# EAGLE design relais-adapter (EAGLE 7.5.0)
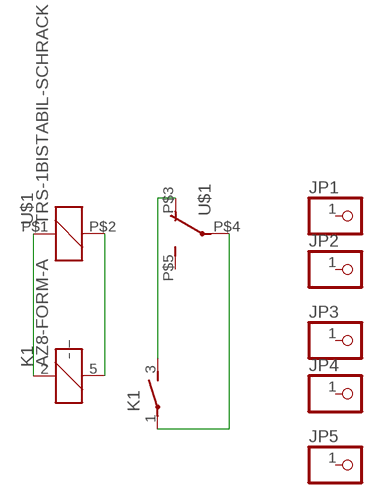
[diagram p0: schematic, sheet 1]

## Parts
JP1  PINHD-1X1  [1X01]
JP2  PINHD-1X1  [1X01]
JP3  PINHD-1X1  [1X01]
JP4  PINHD-1X1  [1X01]
JP5  PINHD-1X1  [1X01]
K1  AZ8-FORM-A  [AZ8]
U$1  TRS-1BISTABIL-SCHRACK  [PRINTRELAIS-SCHRACK-PE-BISTABIL]

## Nets
N$1: K1.2 U$1.P$1
N$2: K1.5 U$1.P$2
N$3: K1.3(-1:S) U$1.P$3(O)
N$4: K1.1(-1:P) U$1.P$4(P)
Unconnected: JP1.1 JP2.1 JP3.1 JP4.1 JP5.1 U$1.P$5(S)

## Library data of the parts
JP1-JP5 = pinhead:PINHD-1X1: PIN HEADER
K1 = 0liver:AZ8-FORM-A: MINIATURE PC BOARD RELAY Form A Source: www.azettler.com .. AZ8-1ch-12DSE.PDF; OC_FARNELL: unknown; OC_NEWARK: unknown
U$1 = 0liver:TRS-1: TRS-1 12V Hochstromrelais Allgemeines Typ Automotive Powerrelais Technologie monostabil Ausführung Ausführung 1x Wechsler Anschlüsse / Schnittstellen Anschluss Printmontage Kontakte AgSnO Elektrische Werte Schaltleistung 420 VA Voltage DC 12 V= Innenwiderstand (Ri) 253 Ohm Nennstrom 30 (16 V DC) A Max. Schaltstrom 30 A Leistungsaufnahme (Betrieb) 0,57 W Prüfspannung 500 V Maße Länge 13,2 mm Breite 12,3 mm Höhe 9,8 mm http://www.reichelt.de/index.html?&ACTION=7&LA=3&OPEN=0&INDEX=0&FILENAME=C300%252FTRS.pdf

## Board
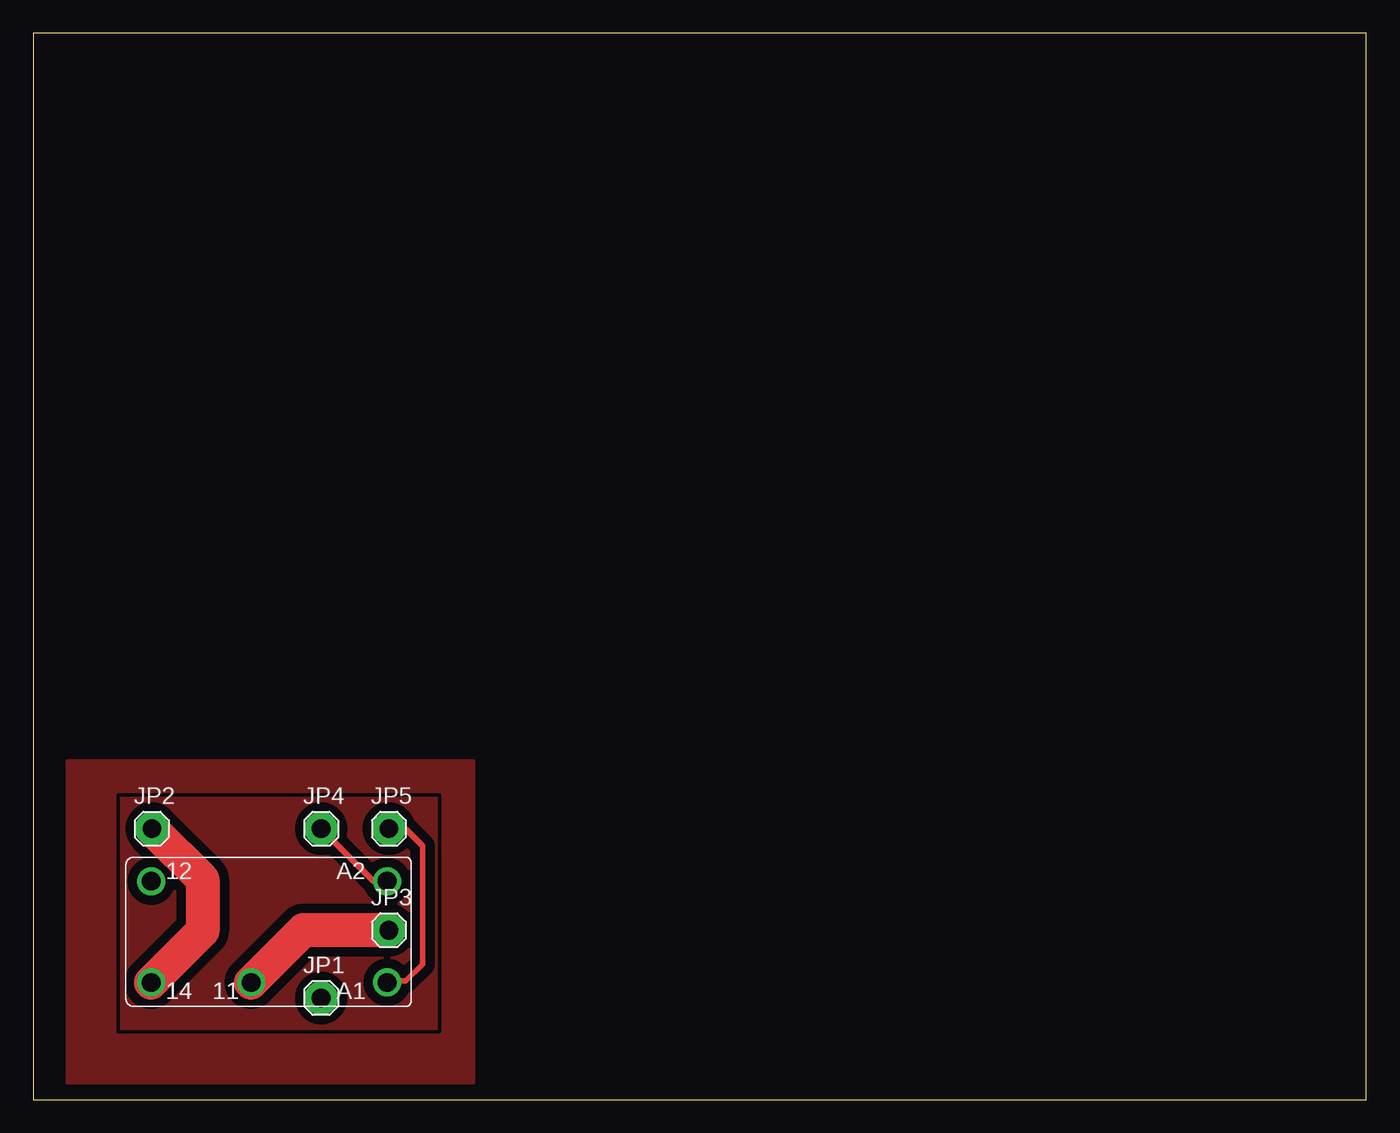
[diagram p1: board, top side]
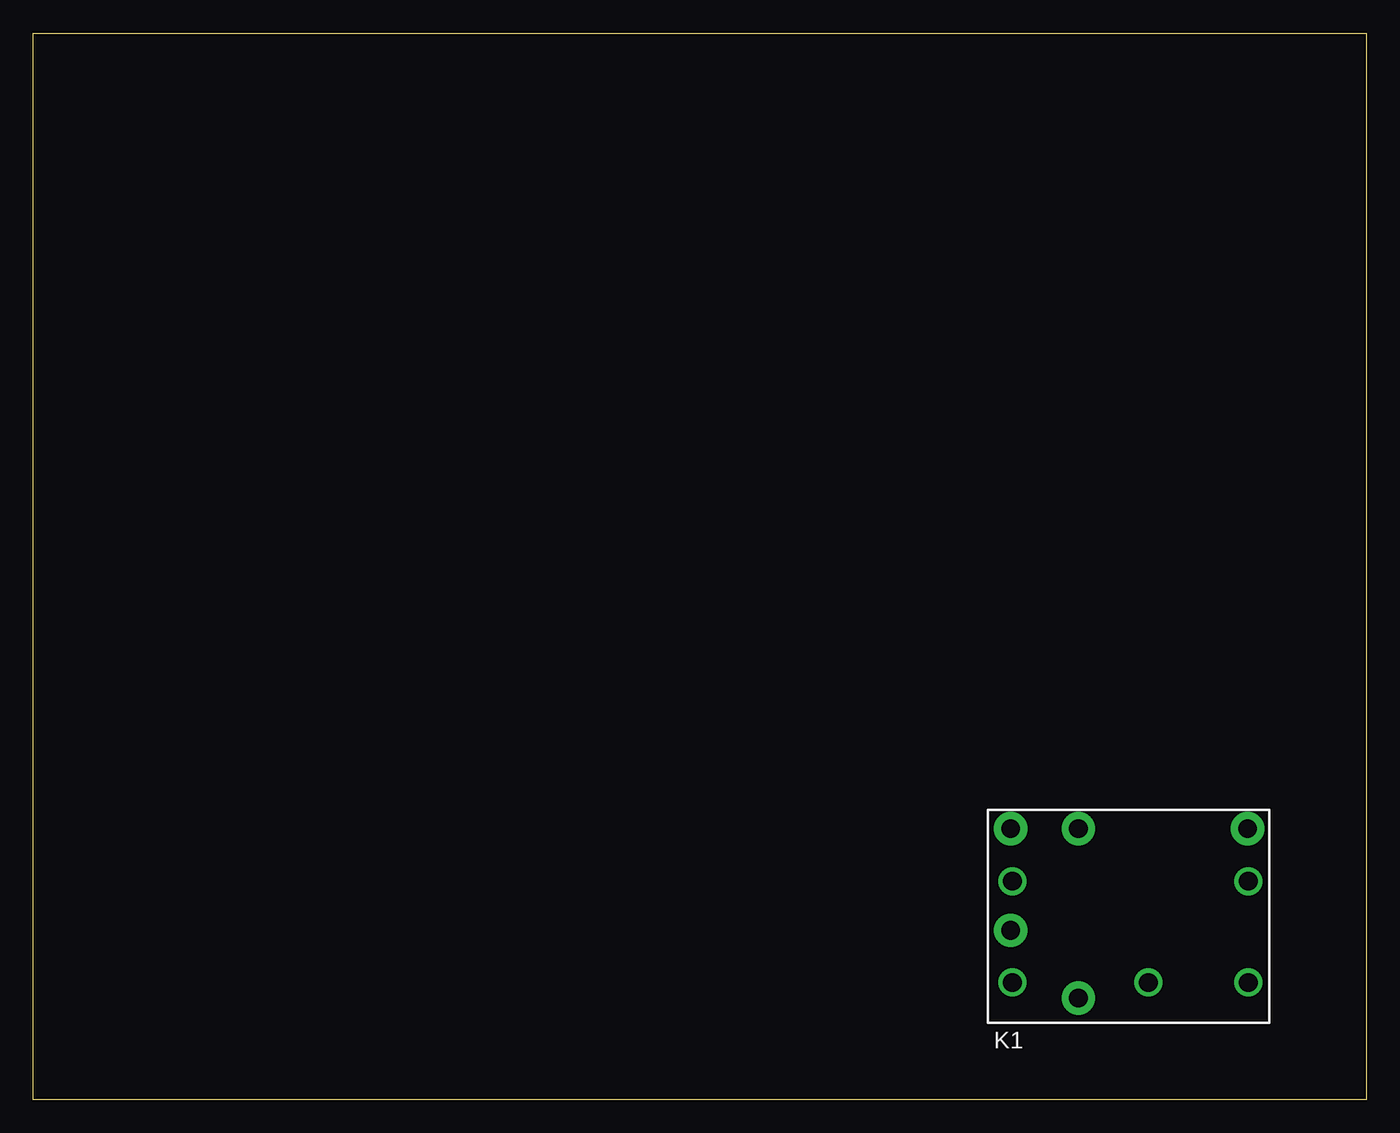
[diagram p2: board, bottom side, seen from below]

Size 100 x 80 mm. Coordinates in mm from the lower left corner, seen from the top.
Outline: 0,0 100,0 100,80 0,80 0,0
Copper layers (1*16): Top 0.035mm / dielectric 1.5mm / Bottom 0.035mm
Design rules "default *": minimum track width 10mil, minimum drill 24mil, track to track 28mil, track to pad 28mil, pad to pad 28mil, via to via 28mil, smd to smd 8mil, copper to edge 40mil, drill to drill 8mil, minimum pad ring 10mil, minimum via ring 8mil, stop-mask expansion 4mil, vias tented up to drill 0mil, thermal gap 10mil
tRestrict: 4 lines

### Footprints (pad centres in the part's own frame; a part is rotated, then mirrored left to right if it is on the bottom)
1X01 = drill 1.016 octagon: 1 0,0
AZ8 = drill 1.4 pad 2.5: 1 8.89,6.35; 2 -3.81,6.35; 3 -8.89,-1.27; 4 -3.81,-6.35; 5 -8.89,6.35
PRINTRELAIS-SCHRACK-PE-BISTABIL = drill 1.4: P$1 1.4,1.4; P$2 1.4,9; P$3 11.6,9; P$4 19.1,9; P$5 19.1,1.4

### Placement (x,y rotation side)
JP1  21.59,7.62 0 top
JP2  8.89,20.32 0 top
JP3  26.67,12.7 0 top
JP4  21.59,20.32 0 top
JP5  26.67,20.32 0 top
K1  17.78,13.97 0 bottom
U$1  27.94,17.78 180 top

### Tracks (layer width: path | path; a pad name or v marks a point on that pad's centre or on a via)
N$1
  Top 0.406: U$1.P$1 25.53,16.38 K1.2
N$2
  Top 0.406: K1.5 27.94,20.32 29.21,19.05 29.21,10.16 27.94,8.89 26.65,8.89 U$1.P$2
N$3
  Top 2.54: K1.3 20.26,12.7 U$1.P$3
N$4
  Top 2.54: K1.1 12.7,16.51 12.7,12.64 U$1.P$4
N$5
  pour Top: 2.54,25.4 33.02,25.4 33.02,1.27 2.54,1.27